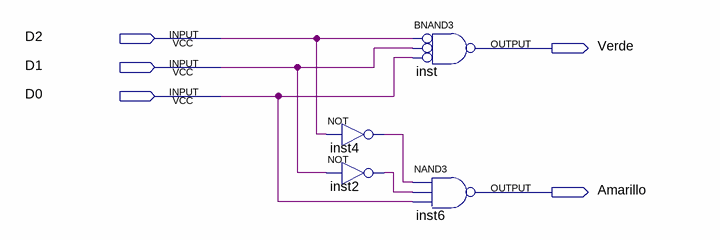
[diagram p0: schematic sheet]
// Quartus schematic Semaforo1.bdf as structural Verilog: 4 symbols, 5 pins
module Semaforo1 (
  input  D2,
  input  D1,
  input  D0,
  output Verde,
  output Amarillo
);

  wire inst2_out, inst4_out;

  not inst4 (inst4_out, D2);
  not inst2 (inst2_out, D1);
  nand inst (Verde, ~D2, ~D1, ~D0);  // BNAND3
  nand inst6 (Amarillo, inst4_out, inst2_out, D0);
endmodule
